# EAGLE design mapleCUL_small_31 (EAGLE 7.3.0)
MAPLE-CUx Large Version
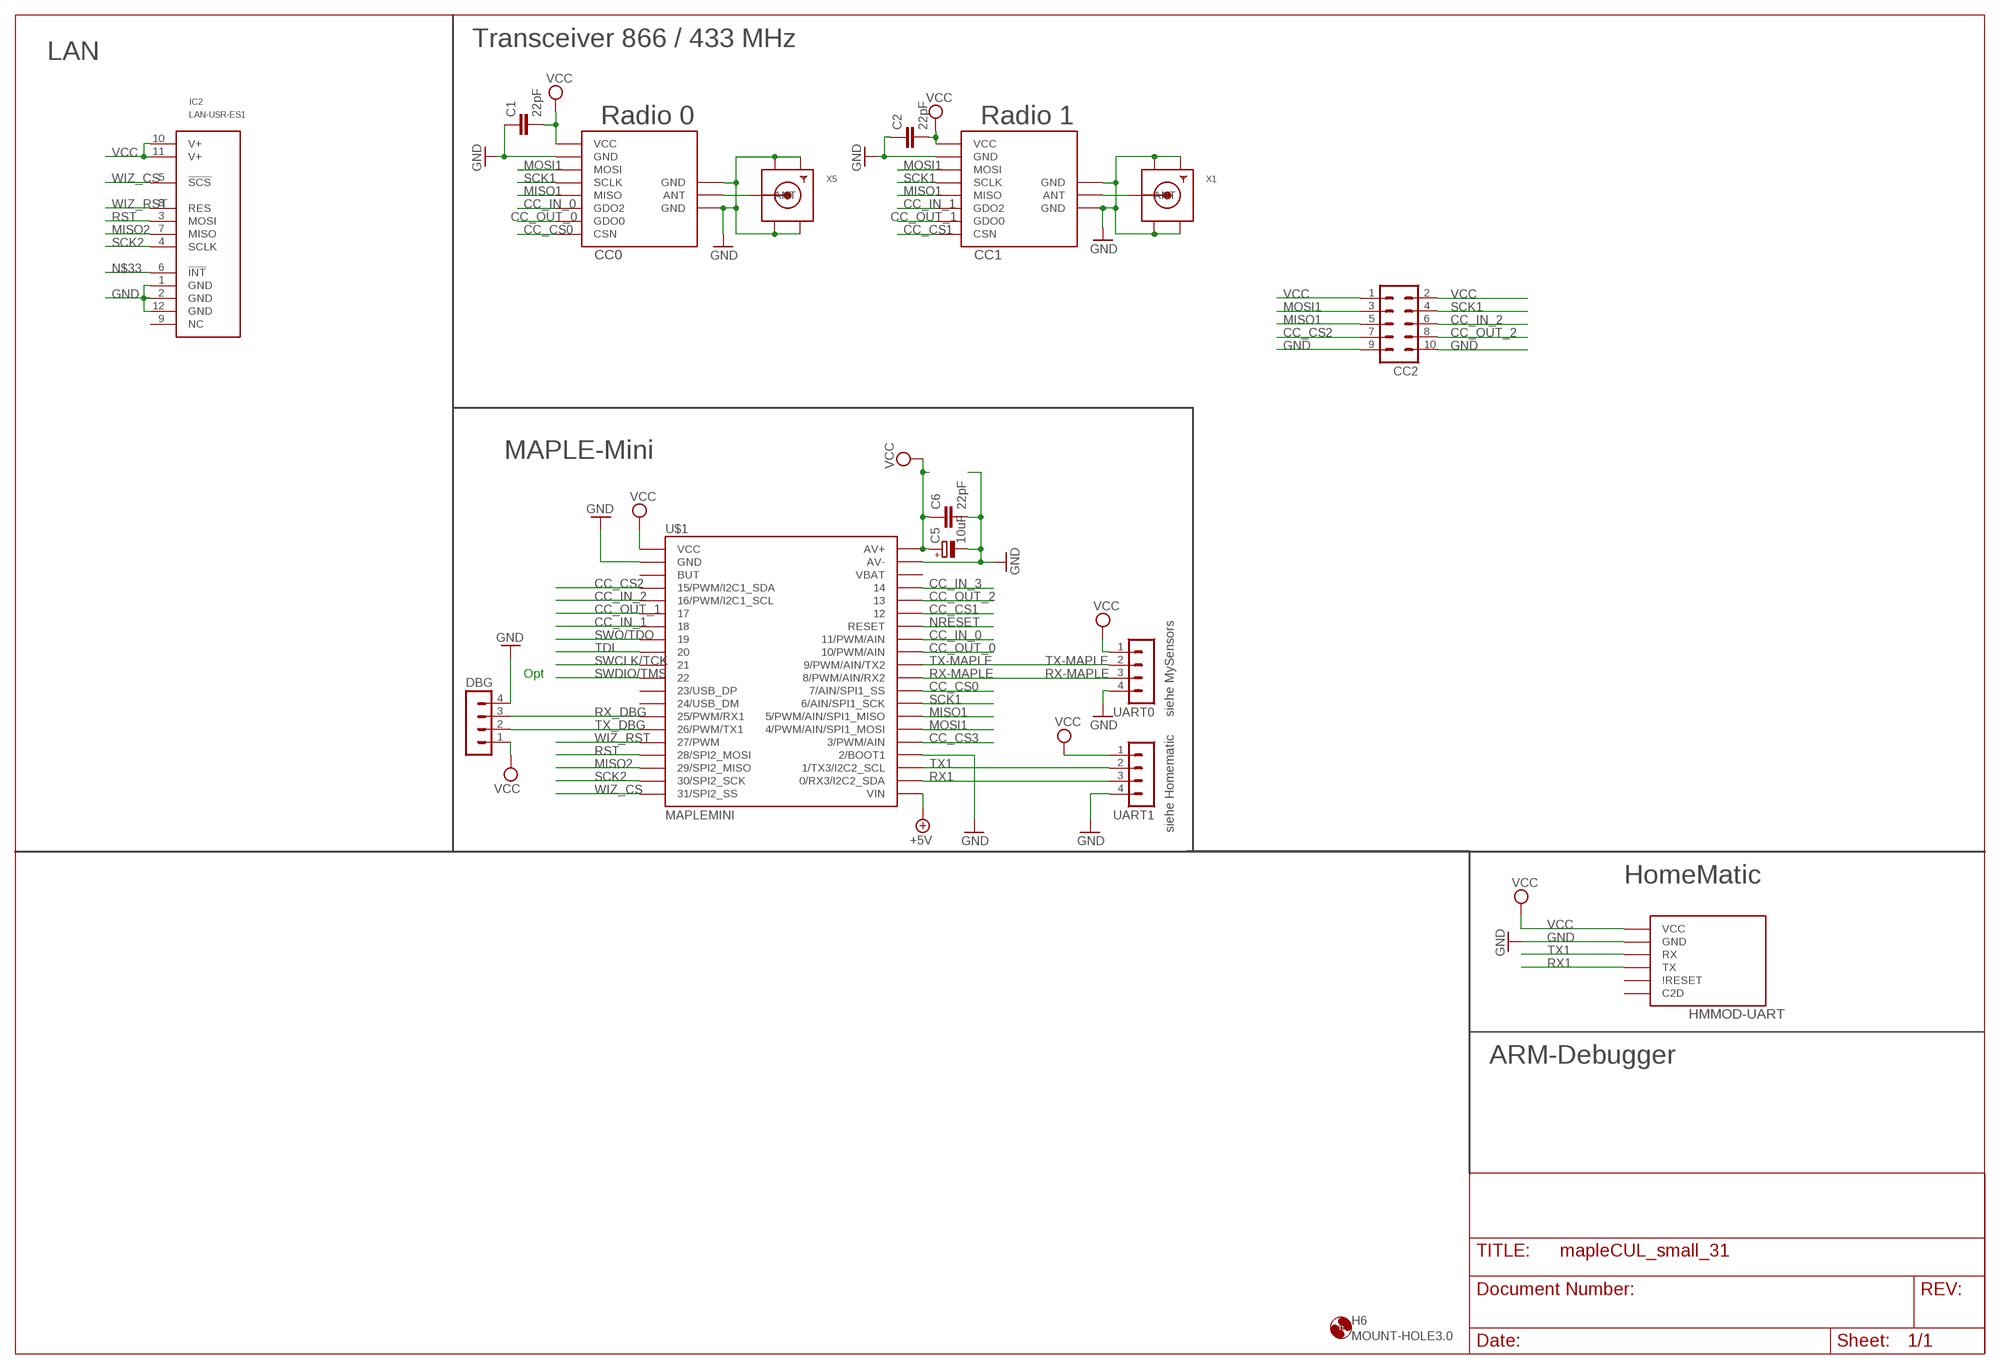
[diagram p0: schematic, sheet 1]

## Parts
C1  22pF  C-EUC0805  [C0805]
C2  22pF  C-EUC0805  [C0805]
C5  10uF  CPOL-EUR/2012-12W  [R/2012-12W]
C6  22pF  C-EUC0805  [C0805]
CC0  CC1101  CC1101_MODULE1SMD  [CC1101_MODULE1_SMD]
CC1  CC1101_MODULE1SMD  [CC1101_MODULE1_SMD]
CC2  MA05-2  [MA05-2]
DBG  MA04-1  [MA04-1]
H6  MOUNT-HOLE3.0  [3,0]
HMMOD-UART  HM-MOD-UARTDIL  [HM-MOD-UART-DIL]
IC2  LAN-USR-ES1  [USR-ES1]
U$1  MAPLEMINI  [20-DIP]
UART0  MA04-1  [MA04-1]
UART1  MA04-1  [MA04-1]
X1  SMACONNECTOR_EDGE_UFL  [SMA_EDGELAUNCH_UFL]
X5  SMACONNECTOR_EDGE_UFL  [SMA_EDGELAUNCH_UFL]

## Nets
+5V [PWR]: U$1.21(VIN)
CC_CS0: CC0.CSN U$1.29(7/AIN/SPI1_SS)
CC_CS1: CC1.CSN U$1.35
CC_CS2: CC2.7 U$1.4(15/PWM/I2C1_SDA)
CC_CS3: U$1.25(3/PWM/AIN)
CC_IN_0: CC0.GDO2 U$1.33(11/PWM/AIN)
CC_IN_1: CC1.GDO2 U$1.7
CC_IN_2: CC2.6 U$1.5(16/PWM/I2C1_SCL)
CC_IN_3: U$1.37
CC_OUT_0: CC0.GDO0 U$1.32(10/PWM/AIN)
CC_OUT_1: CC1.GDO0 U$1.6
CC_OUT_2: CC2.8 U$1.36
GND [PWR]: C1.1 C2.1 C5.- C6.2 CC0.GND@0(GND) CC0.GND@1(GND) CC0.GND@2(GND) CC1.GND@0(GND) CC1.GND@1(GND) CC1.GND@2(GND) CC2.9 CC2.10 DBG.4 HMMOD-UART.2(GND) IC2.1(GND) IC2.2(GND) IC2.12(GND) U$1.2(GND) U$1.24(2/BOOT1) U$1.39(AV-) UART0.4 UART1.4 X1.GND@1(GND1) X1.GND@2(GND2) X1.GND@3(GND3) X1.GND@4(GND4) X5.GND@1(GND1) X5.GND@2(GND2) X5.GND@3(GND3) X5.GND@4(GND4)
MISO1: CC0.MISO CC1.MISO CC2.5 U$1.27(5/PWM/AIN/SPI1_MISO)
MISO2: IC2.7(MISO) U$1.18(29/SPI2_MISO)
MOSI1: CC0.MOSI CC1.MOSI CC2.3 U$1.26(4/PWM/AIN/SPI1_MOSI)
N$1: CC1.ANT X1.P(ANT)
N$4: CC0.ANT X5.P(ANT)
N$33: IC2.6(!INT!)
NRESET: U$1.34(RESET)
RST: IC2.3(MOSI) U$1.17(28/SPI2_MOSI)
RX1: HMMOD-UART.5(TX) U$1.22(0/RX3/I2C2_SDA) UART1.3
RX-MAPLE: U$1.30(8/PWM/AIN/RX2) UART0.3
RX_DBG: DBG.3 U$1.14(25/PWM/RX1)
SCK1: CC0.SCLK CC1.SCLK CC2.4 U$1.28(6/AIN/SPI1_SCK)
SCK2: IC2.4(SCLK) U$1.19(30/SPI2_SCK)
SWCLK/TCK: U$1.10
SWDIO/TMS: U$1.11
SWO/TDO: U$1.8
TDI: U$1.9
TX1: HMMOD-UART.6(RX) U$1.23(1/TX3/I2C2_SCL) UART1.2
TX-MAPLE: U$1.31(9/PWM/AIN/TX2) UART0.2
TX_DBG: DBG.2 U$1.15(26/PWM/TX1)
VCC [PWR]: C1.2 C2.2 C5.+ C6.1 CC0.VCC CC1.VCC CC2.1 CC2.2 DBG.1 HMMOD-UART.1(VCC) IC2.10(V+) IC2.11(V+) U$1.1(VCC) U$1.40(AV+) UART0.1 UART1.1
WIZ_CS: IC2.5(!SCS!) U$1.20(31/SPI2_SS)
WIZ_RST: IC2.8(RES) U$1.16(27/PWM)
Unconnected: HMMOD-UART.3(C2D) HMMOD-UART.4(\!RESET) IC2.9(NC) U$1.3(BUT) U$1.12(23/USB_DP) U$1.13(24/USB_DM) U$1.38(VBAT)

## Notes on the sheet
- Transceiver 866 / 433 MHz
- LAN
- Radio 0 | Radio 1
- MAPLE-Mini
- Opt
- siehe MySensors
- siehe Homematic
- HomeMatic
- ARM-Debugger

## Library data of the parts
C1 C2 C6 = rcl:C-EU: CAPACITOR, European symbol
C5 = rcl:CPOL-EU: POLARIZED CAPACITOR, European symbol
CC0 CC1 = wireless:CC1101_MODULE1: CC1101 wireless module for 433/868 MHz (sold from Aliexpress). DIL version for mounting with pin header (and SMD soldering) and SMD only variant available.
CC2 = con-lstb:MA05-2: PIN HEADER; OC_FARNELL: unknown; OC_NEWARK: unknown
DBG UART0 UART1 = con-lstb:MA04-1: PIN HEADER; OC_FARNELL: unknown; OC_NEWARK: unknown
H6 = holes:MOUNT-HOLE: MOUNTING HOLE with drill center marker
HMMOD-UART = wireless:HM-MOD-UART: eQ3 HM-MOD-UART-AW-SH2 wireless module for 868 MHz. DIL version for mounting with pin header (antenna upwards) and SMD variant available (antenna downwards).
IC2 = Martin-Communication:LAN-USR-ES1
U$1 = maplemini-small:MAPLEMINI
X1 X5 = adafruit:SMACONNECTOR: SMA Connector 90° DIP SMA Connector, 50 Ohm (4UConnector: 07259)

## Net classes
0 default: width 0.305 mm
1 PWR: width 0.305 mm

## Board
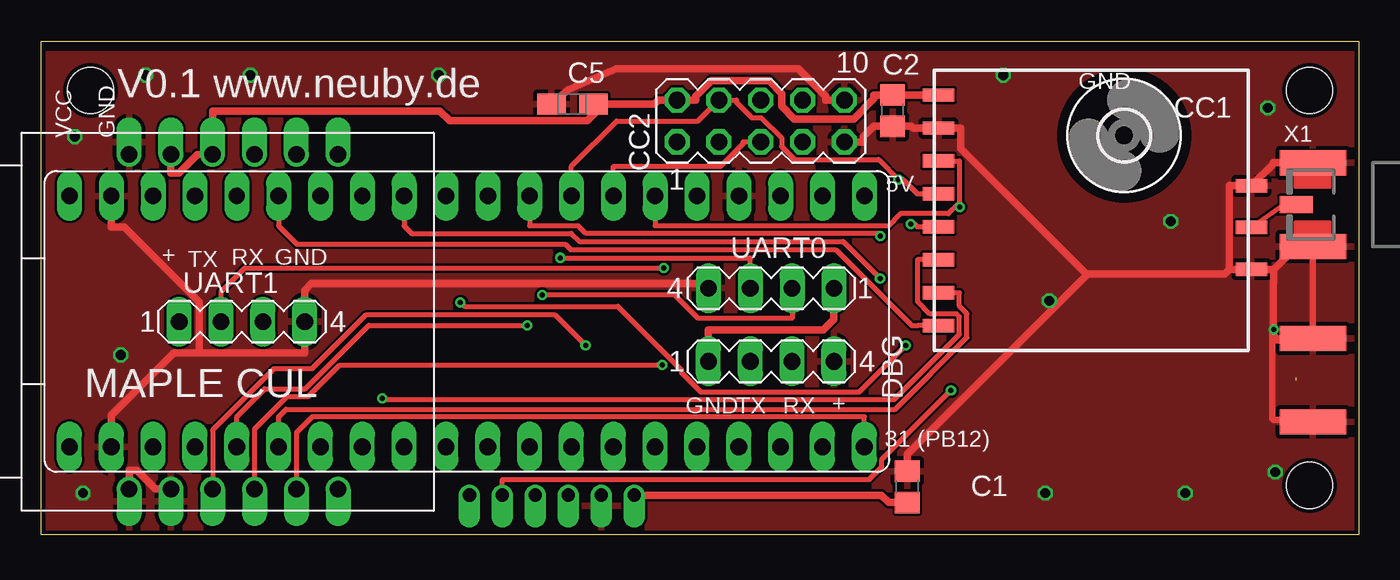
[diagram p1: board, top side]
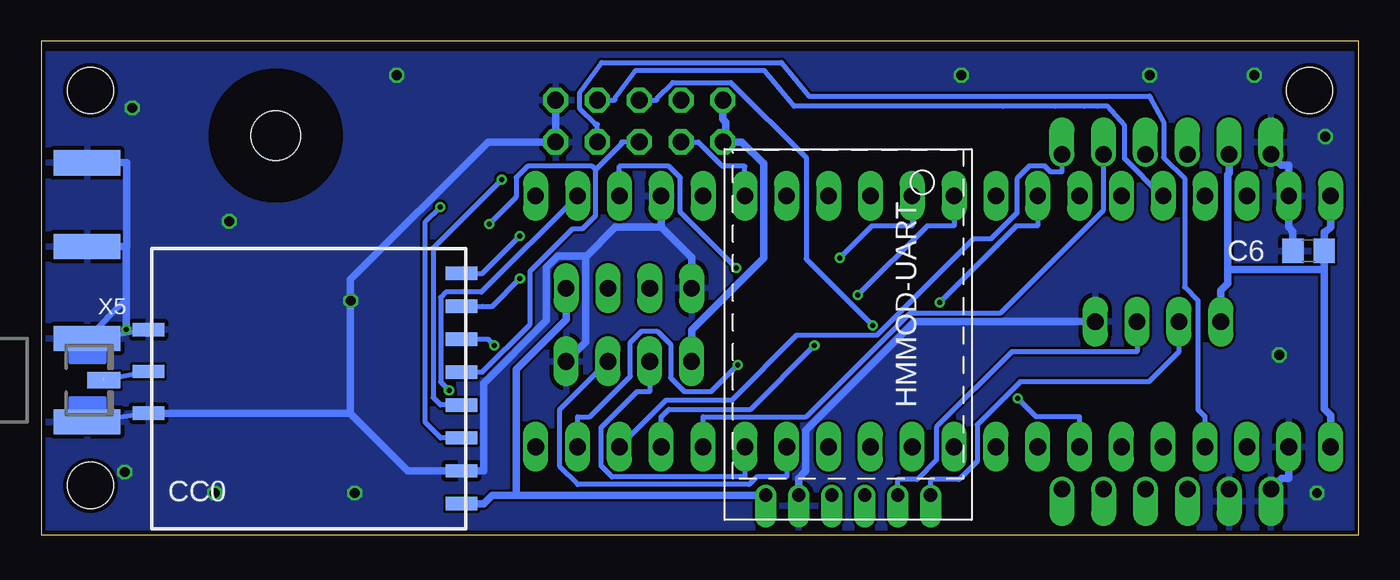
[diagram p2: board, bottom side, seen from below]

Size 80 x 30 mm. Coordinates in mm from the lower left corner, seen from the top.
Outline: 0,0 0,30 80,30 80,0 1,0 0,0
Copper layers (1*16): Top 0.035mm / dielectric 1.5mm / Bottom 0.035mm
Design rules "SeeedStudio_2layer_DRU_no_angle_20140221": minimum track width 6mil, minimum drill 12mil, track to track 6mil, track to pad 6mil, pad to pad 6mil, via to via 6mil, smd to smd 0mil, copper to edge 10mil, drill to drill 10mil, minimum pad ring 10mil, minimum via ring 6mil, stop-mask expansion 2mil, vias tented up to drill 100mil, thermal gap 10mil
Holes 2.8 mm at 3,27 77,27 77,3

### Footprints (pad centres in the part's own frame; a part is rotated, then mirrored left to right if it is on the bottom)
C0805 = smd 1.3 x 1.5: 1 -0.95,0; 2 0.95,0
R/2012-12W = smd 1.75 x 1.26: + 1.275,0; - -1.275,0
CC1101_MODULE1_SMD = smd 1.93 x 0.813: ANT 19,5.96; CSN 0,0; GDO0 0,2; GDO2 0,4; GND@0 0,12; GND@1 19,8.5; GND@2 19,3.42; MISO 0,6; MOSI 0,10; SCLK 0,8; VCC 0,14
MA05-2 = drill 1.016 octagon: 1 -5.08,-1.27; 2 -5.08,1.27; 3 -2.54,-1.27; 4 -2.54,1.27; 5 0,-1.27; 6 0,1.27; 7 2.54,-1.27; 8 2.54,1.27; 9 5.08,-1.27; 10 5.08,1.27
MA04-1 = drill 1.016 long: 1 -3.81,0; 2 -1.27,0; 3 1.27,0; 4 3.81,0
3,0 = hole 3: 0,0
HM-MOD-UART-DIL = drill 0.8 offset: 1 0,12; 2 0,10; 3 0,8; 4 0,6; 5 0,4; 6 0,2
USR-ES1 = drill 1 pad 1.35 offset: 1 -10.16,5.715; 2 -10.16,3.175; 3 -10.16,0.635; 4 -10.16,-1.905; 5 -10.16,-4.445; 6 -10.16,-6.985; 7 10.16,-6.985; 8 10.16,-4.445; 9 10.16,-1.905; 10 10.16,0.635; 11 10.16,3.175; 12 10.16,5.715
20-DIP = drill 1.016 pad 1.27 long: 1 -24.13,-7.62; 2 -21.59,-7.62; 3 -19.05,-7.62; 4 -16.51,-7.62; 5 -13.97,-7.62; 6 -11.43,-7.62; 7 -8.89,-7.62; 8 -6.35,-7.62; 9 -3.81,-7.62; 10 -1.27,-7.62; 11 1.27,-7.62; 12 3.81,-7.62; 13 6.35,-7.62; 14 8.89,-7.62; 15 11.43,-7.62; 16 13.97,-7.62; 17 16.51,-7.62; 18 19.05,-7.62; 19 21.59,-7.62; 20 24.13,-7.62 | drill 1 pad 1.27 long: 21 24.13,7.62; 22 21.59,7.62; 23 19.05,7.62; 24 16.51,7.62; 25 13.97,7.62; 26 11.43,7.62; 27 8.89,7.62; 28 6.35,7.62; 29 3.81,7.62; 30 1.27,7.62; 31 -1.27,7.62; 32 -3.81,7.62; 33 -6.35,7.62; 34 -8.89,7.62; 35 -11.43,7.62; 36 -13.97,7.62; 37 -16.51,7.62; 38 -19.05,7.62; 39 -21.59,7.62; 40 -24.13,7.62
SMA_EDGELAUNCH_UFL = smd 4.064 x 1.524: GND@1 2.032,-2.54; GND@2 2.032,2.54 | smd 4.064 x 1.524 bottom: GND@3 2.032,2.54; GND@4 2.032,-2.54 | smd 2.032 x 1.016: P 3.048,0

### Placement (x,y rotation side)
C1  52.58,2.92 270 top
C2  51.69,25.78 90 top
C5  32.26,26.18 0 top
C6  3.05,17.26 180 bottom
CC0  54.48,15.89 180 bottom
CC1  54.48,12.72 0 top
CC2  43.69,25.15 0 top
DBG  44.32,10.54 0 top
H6  65.75,24.27 0 top
HMMOD-UART  24,2.41 90 bottom
IC2  11.05,12.95 90 top
U$1  25.84,12.97 0 top
UART0  44.32,14.99 180 top
UART1  12.19,12.95 0 top
X1  79.25,20.07 180 top
X5  79.25,9.4 0 bottom

### Tracks (layer width: path | path; a pad name or v marks a point on that pad's centre or on a via)
CC_CS0  (via drill 0.3 pad 0.61)
  Top 0.305: v50.96,18.15 50.78,18.32 33.07,18.32 32.61,18.78 29.65,18.78 U$1.29
  Bottom 0.305: v50.96,18.15 53.21,15.89 CC0.CSN
CC_CS1
  Top 0.305: CC1.CSN 53.21,12.72 52.86,12.72 48.24,17.33 32.14,17.33 31.81,17.66 15.53,17.66 14.41,18.78 U$1.35
CC_CS2
  Bottom 0.305: U$1.4 9.34,7.18 9.78,7.62 9.78,14.25 10.58,15.05 10.58,21.67 11.85,22.93 11.85,25.08 12.64,26.5 12.7,26.67 33.4,26.67 35.05,28.7 45.97,28.7 47.3,26.88 47.3,25.88 46.36,24.94 46.23,24.94 CC2.7
CC_IN_0  (via drill 0.3 pad 0.61)
  Top 0.305: v25.46,14.13 25.7,13.88 35.02,13.88 38.87,10.03 38.87,9.86 40.05,8.68 49.67,8.68 v52.49,11.5
  Bottom 0.305: v52.49,11.5 52.88,11.89 53.21,11.89 CC0.GDO2 | v25.46,14.13 20.81,18.78 19.49,18.78 U$1.33
CC_IN_1  (via drill 0.3 pad 0.61)
  Top 0.305: v20.7,8.28 20.75,8.22 51.79,8.22 55.75,12.18 55.75,13.25 55.58,13.43 53.96,13.43 53.21,14.18 53.21,16.72 CC1.GDO2
  Bottom 0.305: v20.7,8.28 19.6,7.18 16.95,7.18 U$1.7
CC_IN_2  (via drill 0.3 pad 0.61)
  Top 0.305: v29.52,12.73 19.9,12.73 16.04,8.87 13.56,8.87 11.87,7.18 U$1.5
  Bottom 0.305: v29.52,12.73 33.55,16.76 33.55,22.92 38.12,27.49 41.66,27.49 42.62,26.53 42.62,26.42 CC2.6
CC_OUT_0  (via drill 0.3 pad 0.61)
  Top 0.305: v50.93,15.59 48.69,17.83 32.69,17.83 32.19,18.32 22.49,18.32 22.04,18.78 U$1.32
  Bottom 0.305: v50.93,15.59 52.62,13.89 53.21,13.89 CC0.GDO0
CC_OUT_1
  Top 0.305: 55.75,13.89 56.21,13.44 56.21,11.99 51.85,7.64 14.87,7.64 14.41,7.18 U$1.6 | 55.75,13.89 | 55.75,13.89 55.75,14.72 CC1.GDO0
CC_OUT_2
  Bottom 0.305: CC2.8 45.16,26.42 45.16,26.53 43.94,28.19 36.07,28.19 34.29,26.04 21.59,26.04 18.41,26.04 16.66,26.05 15.88,26.04 15.24,26.04 14.22,24.89 14.22,22.85 11.96,20.59 U$1.36
GND  (via drill 0.3 pad 0.61, 0.6)
  Top 0.305: 75.7,17.01 76.7,17.01 X1.GND@2 76.76,17.07 75.77,17.07
  Top 0.406: v74.83,12.47 74.8,12.45 74.8,11.81 | X5.GND@2 77.09,11.81 | 77.09,11.81 74.8,11.81 | X5.GND@2 77.09,11.81 | 77.09,11.81 74.8,11.81 | X5.GND@1 77.09,6.99 74.8,6.99 74.73,7.06 74.73,11.94 | 74.73,11.94 74.73,12.26 75.05,11.94 X5.GND@2 | X5.GND@2 74.73,11.94 | X5.GND@2 X1.GND@2
  Top 0.457: C1.1 52.58,4.9 63.44,15.76 63.44,15.86 | 63.44,15.86 55.83,23.46 55.83,24.72 CC1.GND@0 52.94,24.72 52.82,24.83 C2.1 50.56,24.83 49.91,24.18 49.91,23.88 CC2.9 | 72.14,16.14 71.86,15.86 63.44,15.86 | UART0.4 40.23,15.27 16.41,15.27 16,14.86 UART1.4 16,11.05 9.59,11.05 | IC2.1 5.33,3.93 5.8,3.93 6.94,2.79 IC2.2 | 9.59,11.05 9.59,14.16 5.04,18.7 4.25,18.7 U$1.39 | 9.59,11.05 8.05,11.05 4.25,7.25 U$1.2 | X1.GND@1 74.8,22.61 74.8,22.54 CC1.GND@1 72.14,21.22 72.14,16.14 | 72.14,16.14 CC1.GND@2 74.02,16.14 74.83,16.14 | CC2.10 47.62,26.42 47.62,26.65 45.95,28.32 34.91,28.32 32,27.06 C5.- | X1.GND@2 76.22,17.53 75.77,17.07 75.7,17.01 74.83,16.14 | 74.8,11.81 74.8,15.35 74.83,15.38 74.83,16.14
  Bottom 0.305: CC0.GND@2 76.58,11.94 X5.GND@2 | CC0.GND@1 X5.GND@1
  Bottom 0.406: X5.GND@2 74.83,14.32 74.83,15.38
  Bottom 0.457: 61.23,7.39 61.23,15.51 52.87,23.88 CC2.9 48.77,25.27 CC2.10 | 75.01,17.53 74.83,17.34 74.83,15.38 v74.83,12.47 | 75.01,17.53 74.8,17.53 74.8,22.61 X1.GND@1 | 75.01,17.53 75.06,17.53 X1.GND@2 | 61.23,7.39 57.73,3.89 CC0.GND@0 53.14,3.89 53.14,9.21 49.33,13.02 49.33,16.24 48.63,16.94 46.99,16.94 46.94,16.89 | 61.23,7.39 72.14,7.39 CC0.GND@1 | 46.94,16.89 45.13,18.7 42.35,18.7 | DBG.4 46.94,11.73 46.94,16.89 | HMMOD-UART.2 34,3.45 33.57,3.88 33.57,6.35 26.97,12.95 UART1.4 | UART0.4 40.51,16.89 40.55,16.89 42.35,18.7 | U$1.24 42.35,18.7 | U$1.2 4.25,3.44 4.68,3.44 IC2.1 | IC2.12 4.7,22.48 4.25,22.48 U$1.39 4.25,20.28 4.25,18.7 4,18.44 C6.2
  other vias: 2.03,24.19 12.7,27.94 6.35,27.94 4.83,10.92 2.54,2.54 58.42,27.94 61.21,14.22 60.96,2.54 69.47,2.54 74.93,3.81 74.47,25.94 68.58,19.05 24.13,27.94
  pour Bottom: 0,0 0,29.21 80.26,29.21 80.01,0
  pour Top: -0.76,29.21 80.77,29.21 80.77,28.96 80.77,-0.76 -0.76,-0.76
MISO1  (via drill 0.3 pad 0.61)
  Top 0.305: CC1.MISO 53.21,18.72 53.03,18.9 v52.79,18.9 | CC2.5 42.62,23.88 42.62,23.77 41.26,22.4 34.73,22.4 U$1.27
  Bottom 0.305: 46.34,22.19 46.55,22.4 50.46,22.4 51.16,21.71 51.16,20.54 v52.79,18.9 | 46.34,22.19 46.34,19.39 47.13,18.6 47.73,18.6 50.31,16.02 50.31,12.8 53.21,9.89 CC0.MISO | 46.34,22.19 | 46.34,22.19 44.76,23.77 44.76,23.88 CC2.5
MISO2
  Bottom 0.305: U$1.18 42.07,8.17 38.09,8.17 34.15,12.12 29.27,12.12 23.41,17.98 22.33,17.98 20.77,19.55 20.77,21.65 20,22.41 19.07,22.41 18.71,22.05 18.03,22.05 IC2.7
MOSI1  (via drill 0.3 pad 0.61)
  Top 0.305: 55.64,20.06 v55.77,19.93 | 55.64,20.06 55.08,19.51 52.16,19.51 51.43,18.78 37.27,18.78 U$1.26 | 55.64,20.06 55.75,20.18 55.75,22.72 CC1.MOSI
  Bottom 0.305: CC0.MOSI 55.75,5.89 56.68,6.82 56.68,19.02 v55.77,19.93 | CC2.3 40.08,23.88 40.08,23.84 38.64,22.4 37.27,22.4 U$1.26
N$1
  Top 0.305: CC1.ANT 75.44,20.07 X1.P
N$4  (1 unrouted)
  Bottom 0.305: 76.2,9.53 76.71,9.4 | CC0.ANT X5.P
RST  (via drill 0.3 pad 0.61)
  Top 0.305: v33.05,11.5 31.2,13.35 19.7,13.35 16.43,10.08 14.13,10.08 10.41,6.37 IC2.3
  Bottom 0.305: v33.05,11.5 36.91,7.64 41.9,7.64 42.35,7.18 U$1.17
RX1  (via drill 0.3 pad 0.61)
  Top 0.305: HMMOD-UART.5 28,3.37 50.27,3.37 51.04,4.14 51.04,4.59 v55.24,8.79
  Bottom 0.305: U$1.22 53.28,14.75 55.43,14.75 55.75,14.42 55.75,9.3 v55.24,8.79 | UART1.3 13.46,11.12 21.07,11.12 25.64,6.55 25.64,4.55 26.82,3.37 28,3.37 HMMOD-UART.5
RX-MAPLE  (via drill 0.3 pad 0.61)
  Top 0.305: v31.51,16.84 43.03,16.84 43.05,16.82 UART0.3
  Bottom 0.305: v31.51,16.84 29.57,18.78 27.11,18.78 U$1.30
RX_DBG
  Bottom 0.305: U$1.14 34.73,3.52 36.56,3.52 37.02,3.06 47.43,3.06 48.51,4.14 48.51,7.63 DBG.3
SCK1  (via drill 0.3 pad 0.61)
  Top 0.305: U$1.28 32.19,22.4 34.94,25.15 39.88,25.15 CC2.4 42.22,26.42 42.22,26.28 43.15,25.35 43.73,25.35 44.96,24.12 44.96,23.6 45.75,22.8 50.84,22.8 v52.05,21.6 52.33,21.6 53.21,20.72 CC1.SCLK
  Bottom 0.305: v52.05,21.6 56.21,17.44 | 56.21,17.44 | 56.21,17.44 56.21,8.35 55.75,7.89 CC0.SCLK
SCK2  (via drill 0.3 pad 0.61)
  Top 0.305: IC2.4 12.95,6.43 14.94,8.41 16.23,8.41 18.14,10.32 v37.72,10.32
  Bottom 0.305: v37.72,10.32 39.32,8.71 40.96,8.71 41.78,9.54 41.78,11.56 42.6,12.38 43.54,12.38 44.22,11.7 44.22,9.64 46.68,7.18 47.43,7.18 U$1.19
TX1  (via drill 0.3 pad 0.61)
  Top 0.305: v37.8,16.23 12.36,16.23 10.92,14.78 UART1.2
  Bottom 0.305: HMMOD-UART.6 26,3.37 24.27,3.37 23.17,4.46 23.17,6.69 20.57,9.3 12.75,9.3 10.92,11.12 UART1.2 | v37.8,16.23 41.18,19.61 41.18,21.69 41.89,22.4 44.9,22.4 U$1.23
TX-MAPLE  (via drill 0.3 pad 0.61)
  Top 0.305: UART0.2 45.59,13.16 39.88,13.16 38.46,14.57 v30.41,14.57
  Bottom 0.305: U$1.31 24.57,18.78 26.21,18.78 v30.41,14.57
TX_DBG
  Bottom 0.305: DBG.2 43.05,8.71 43.81,8.71 46,6.52 46,4.18 45.34,3.52 37.27,3.52 U$1.15
VCC
  Top 0.457: UART0.1 48.13,13.08 47.5,12.45 40.51,12.45 DBG.1 | 34.16,26.18 37.23,26.18 37.47,26.42 CC2.2 39.75,26.42 39.75,26.65 40.68,27.59 44.19,27.59 44.96,26.82 44.96,26.05 45.74,25.27 49.32,25.27 50.56,26.51 50.56,26.73 C2.2 51.86,26.73 52.82,26.73 52.84,26.72 CC1.VCC | 34.16,26.18 33.15,25.17 24.8,25.17 24.21,25.76 10.41,25.76 IC2.10 9.48,23.11 8.34,21.98 7.87,21.98 IC2.11 | C5.+ 34.16,26.18 | C1.2 51.45,1.97 51.01,2.41 HMMOD-UART.1
  Bottom 0.457: 51.17,2.41 51.17,10.05 48.13,13.08 UART0.1 | 2.1,16.12 2.1,7.64 1.71,7.25 U$1.1 | 7.97,16.12 2.1,16.12 | 2.1,16.12 C6.1 2.1,18.39 2.03,18.39 1.71,18.7 U$1.40 | 7.97,16.12 7.97,21.88 7.87,21.98 IC2.11 | 7.97,16.12 7.97,15.27 8.38,14.86 UART1.1 | CC2.2 38.61,25.27 38.42,25.09 38.42,23.88 | 38.42,23.88 37.47,23.88 36.14,22.55 36.14,16.82 40.51,12.45 DBG.1 | CC2.1 38.42,23.88 | 51.17,2.41 HMMOD-UART.1 | 51.17,2.41 52.62,2.41 53.14,1.89 CC0.VCC
WIZ_CS
  Top 0.305: U$1.20 49.97,7.18 16.46,7.18 15.49,6.21 IC2.5
WIZ_RST
  Bottom 0.305: U$1.16 39.81,7.18 33.56,7.18 27.25,13.49 21.75,13.49 15.49,19.75 IC2.8

### Text on the board
tNames: GND | V0.1 www.neuby.de | VCC | GND | 5V | + | TX | RX | GND | MAPLE CUL | RX | GND | TX | + | 31 (PB12)